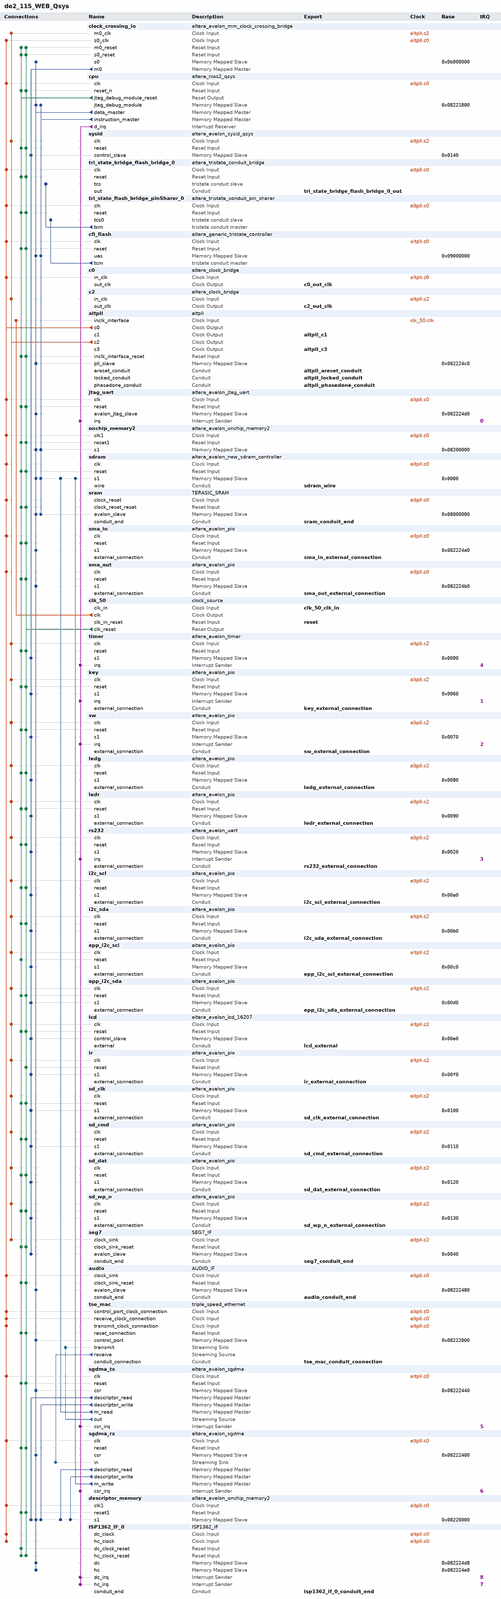
[diagram p0: system contents, whole]
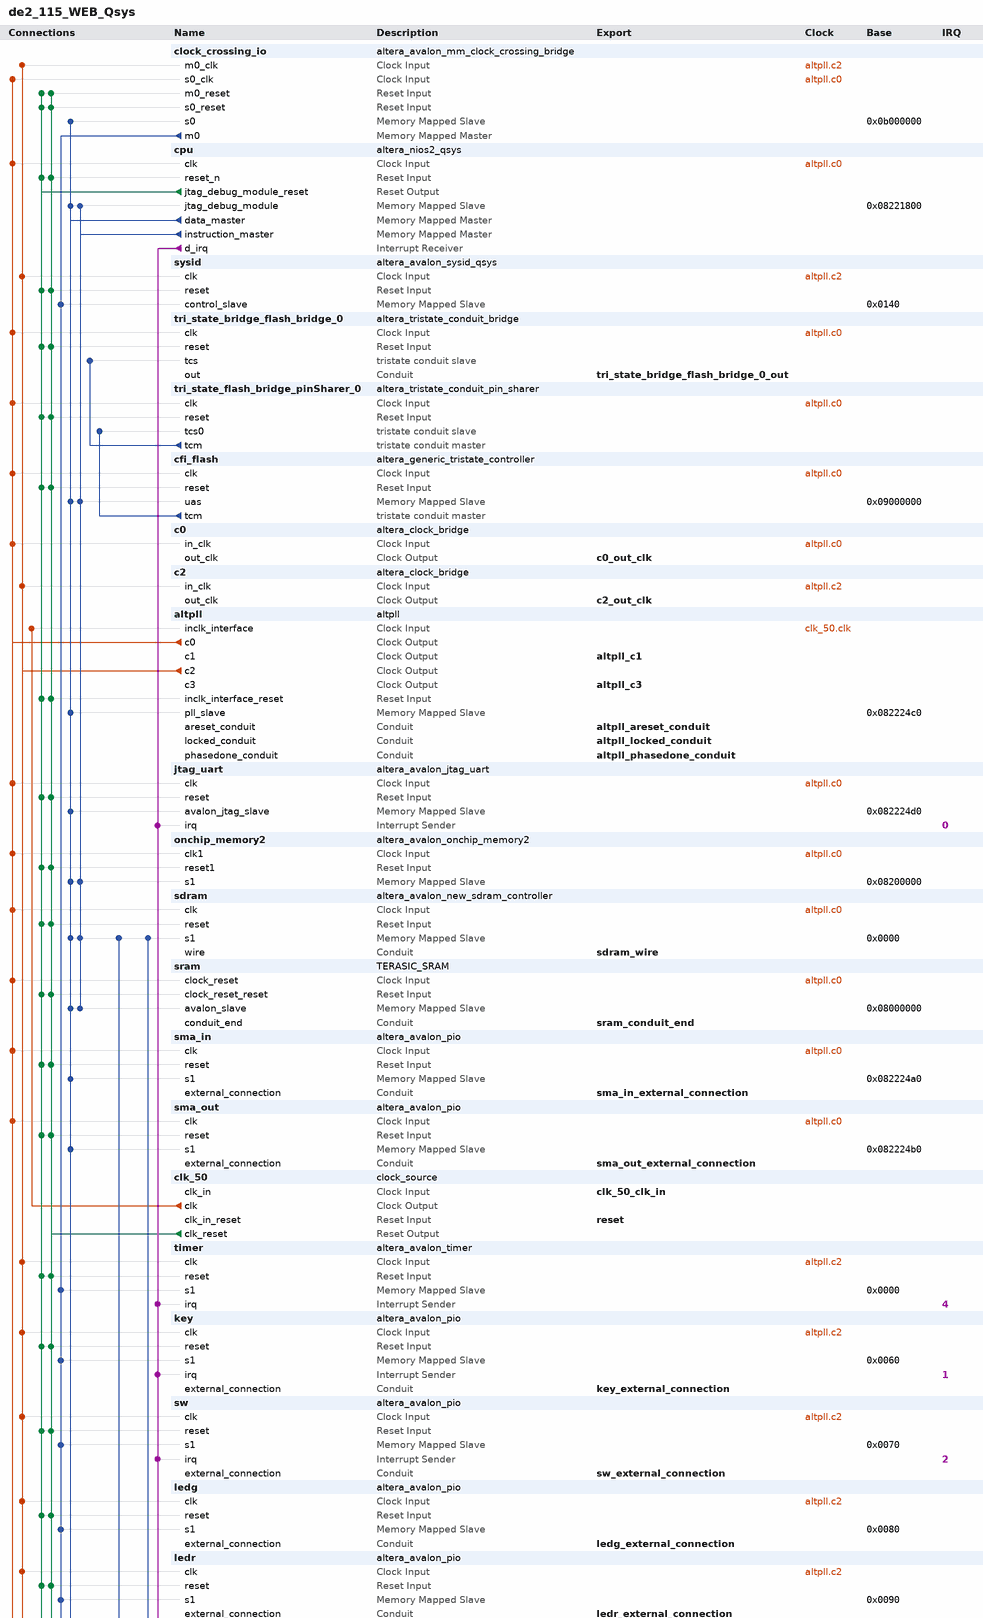
[diagram p1: system contents, upper part]
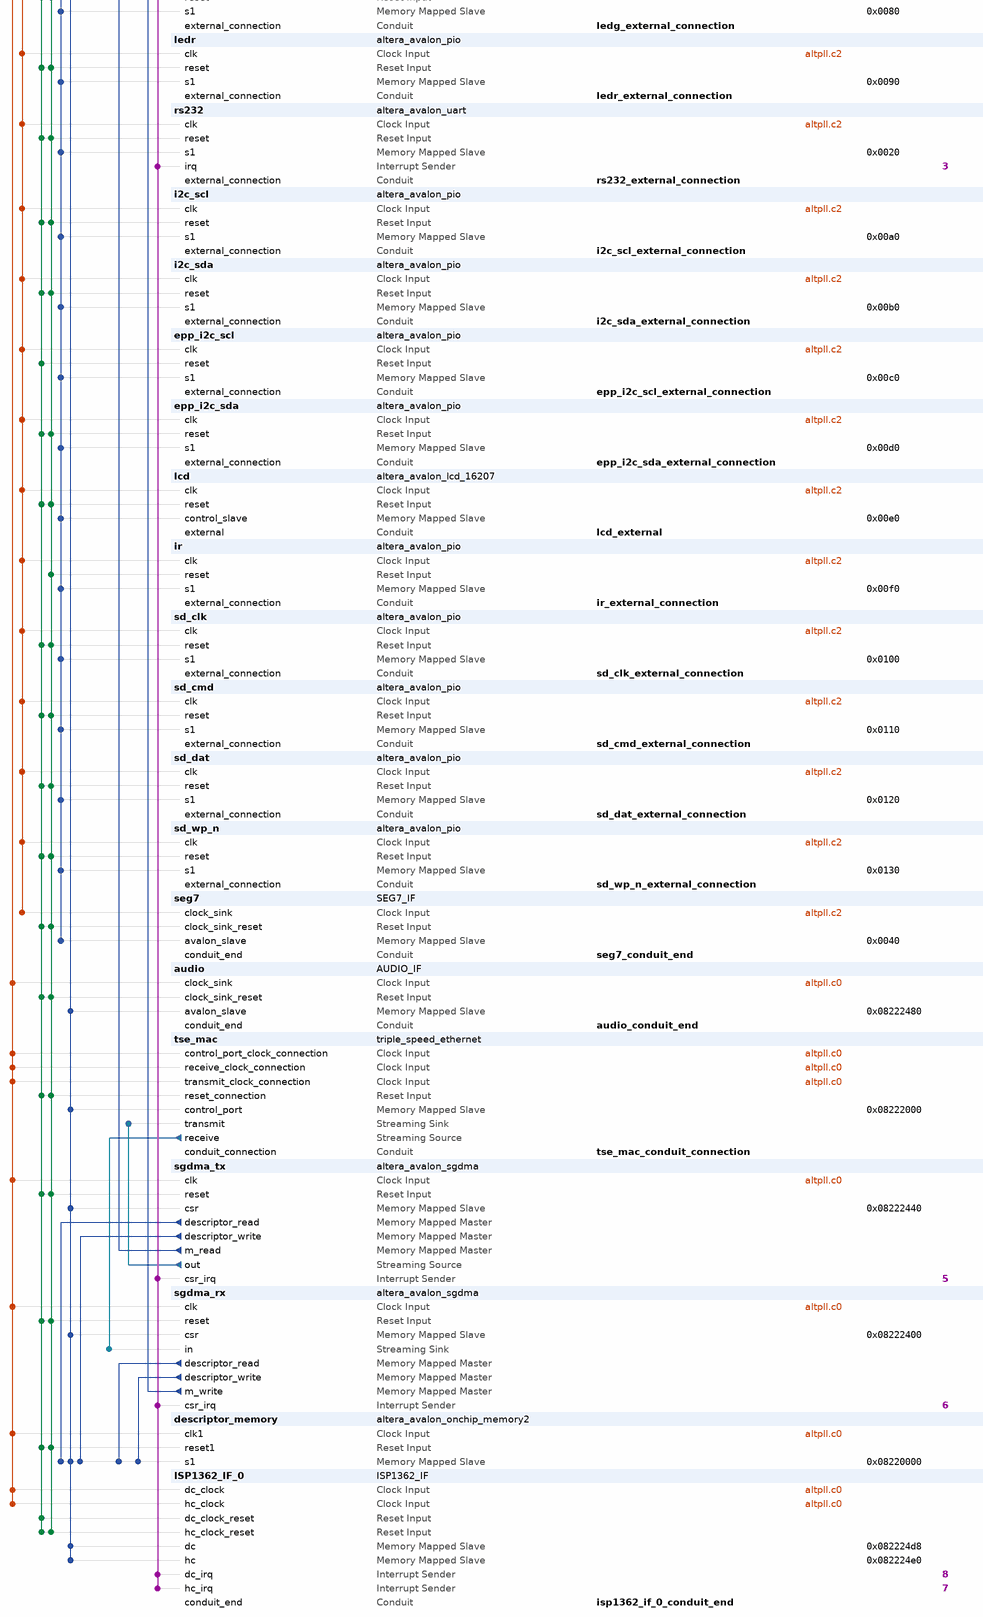
[diagram p2: system contents, lower part]
# Platform Designer (Qsys) system de2_115_WEB_Qsys, Cyclone IV E EP4CE115F29C7
# Parameters at their usual value, and those the tool derives, are not listed.
package require -exact qsys 12.0
create_system de2_115_WEB_Qsys
set_project_property DEVICE_FAMILY {Cyclone IV E}
set_project_property DEVICE EP4CE115F29C7

add_instance clock_crossing_io altera_avalon_mm_clock_crossing_bridge 12.0
set_instance_parameter_value clock_crossing_io DATA_WIDTH 32
set_instance_parameter_value clock_crossing_io ADDRESS_WIDTH 9
set_instance_parameter_value clock_crossing_io MAX_BURST_SIZE 1
set_instance_parameter_value clock_crossing_io COMMAND_FIFO_DEPTH 32
set_instance_parameter_value clock_crossing_io RESPONSE_FIFO_DEPTH 256
set_instance_parameter_value clock_crossing_io MASTER_SYNC_DEPTH 3
set_instance_parameter_value clock_crossing_io SLAVE_SYNC_DEPTH 3

add_instance cpu altera_nios2_qsys 12.0
set_instance_parameter_value cpu resetSlave sdram.s1
set_instance_parameter_value cpu exceptionSlave sdram.s1
set_instance_parameter_value cpu breakSlave cpu.jtag_debug_module
set_instance_parameter_value cpu impl Fast
set_instance_parameter_value cpu icache_size 4096

add_instance sysid altera_avalon_sysid_qsys 12.0
set_instance_parameter_value sysid id 0

add_instance tri_state_bridge_flash_bridge_0 altera_tristate_conduit_bridge 12.0

add_instance tri_state_flash_bridge_pinSharer_0 altera_tristate_conduit_pin_sharer 12.0
set_instance_parameter_value tri_state_flash_bridge_pinSharer_0 NUM_INTERFACES 1
set_instance_parameter_value tri_state_flash_bridge_pinSharer_0 MODULE_ORIGIN_LIST cfi_flash.tcm,cfi_flash.tcm,cfi_flash.tcm,cfi_flash.tcm,cfi_flash.tcm
set_instance_parameter_value tri_state_flash_bridge_pinSharer_0 SHARED_SIGNAL_LIST address_to_the_cfi_flash,read_n_to_the_cfi_flash,write_n_to_the_cfi_flash,tri_state_bridge_flash_data,select_n_to_the_cfi_flash

add_instance cfi_flash altera_generic_tristate_controller 12.0
set_instance_parameter_value cfi_flash TCM_ADDRESS_W 23
set_instance_parameter_value cfi_flash TCM_DATA_W 8
set_instance_parameter_value cfi_flash TCM_BYTEENABLE_W 1
set_instance_parameter_value cfi_flash TCM_READ_WAIT 160
set_instance_parameter_value cfi_flash TCM_WRITE_WAIT 160
set_instance_parameter_value cfi_flash TCM_SETUP_WAIT 60
set_instance_parameter_value cfi_flash TCM_DATA_HOLD 60
set_instance_parameter_value cfi_flash TCM_MAX_PENDING_READ_TRANSACTIONS 3
set_instance_parameter_value cfi_flash TCM_TURNAROUND_TIME 2
set_instance_parameter_value cfi_flash TCM_TIMING_UNITS 0
set_instance_parameter_value cfi_flash TCM_READLATENCY 2
set_instance_parameter_value cfi_flash TCM_SYMBOLS_PER_WORD 1
set_instance_parameter_value cfi_flash USE_READ 1
set_instance_parameter_value cfi_flash USE_BEGINTRANSFER 0
set_instance_parameter_value cfi_flash USE_BYTEENABLE 0
set_instance_parameter_value cfi_flash USE_OUTPUTENABLE 0
set_instance_parameter_value cfi_flash ACTIVE_LOW_READ 1
set_instance_parameter_value cfi_flash ACTIVE_LOW_BYTEENABLE 0
set_instance_parameter_value cfi_flash ACTIVE_LOW_OUTPUTENABLE 0
set_instance_parameter_value cfi_flash ACTIVE_LOW_BEGINTRANSFER 0
set_instance_parameter_value cfi_flash CHIPSELECT_THROUGH_READLATENCY 0
set_instance_parameter_value cfi_flash MODULE_ASSIGNMENT_KEYS embeddedsw.configuration.hwClassnameDriverSupportList,embeddedsw.configuration.hwClassnameDriverSupportDefault,embeddedsw.CMacro.SETUP_VALUE,embeddedsw.CMacro.WAIT_VALUE,embeddedsw.CMacro.HOLD_VALUE,embeddedsw.CMacro.TIMING_UNITS,embeddedsw.CMacro.SIZE,embeddedsw.memoryInfo.MEM_INIT_DATA_WIDTH,embeddedsw.memoryInfo.HAS_BYTE_LANE,embeddedsw.memoryInfo.IS_FLASH,embeddedsw.memoryInfo.GENERATE_DAT_SYM,embeddedsw.memoryInfo.GENERATE_FLASH,embeddedsw.memoryInfo.DAT_SYM_INSTALL_DIR,embeddedsw.memoryInfo.FLASH_INSTALL_DIR
set_instance_parameter_value cfi_flash MODULE_ASSIGNMENT_VALUES altera_avalon_lan91c111:altera_avalon_cfi_flash,altera_avalon_cfi_flash,60,160,60,ns,8388608u,8,0,1,1,1,SIM_DIR,APP_DIR
set_instance_parameter_value cfi_flash INTERFACE_ASSIGNMENT_KEYS embeddedsw.configuration.isFlash,embeddedsw.configuration.isMemoryDevice,embeddedsw.configuration.isNonVolatileStorage
set_instance_parameter_value cfi_flash INTERFACE_ASSIGNMENT_VALUES 1,1,1

add_instance c0 altera_clock_bridge 12.0
set_instance_parameter_value c0 DERIVED_CLOCK_RATE 100000000
set_instance_parameter_value c0 EXPLICIT_CLOCK_RATE 0

add_instance c2 altera_clock_bridge 12.0
set_instance_parameter_value c2 DERIVED_CLOCK_RATE 10000000
set_instance_parameter_value c2 EXPLICIT_CLOCK_RATE 0

add_instance altpll altpll 12.0
set_instance_parameter_value altpll INCLK0_INPUT_FREQUENCY 20000
set_instance_parameter_value altpll CLK0_MULTIPLY_BY 2
set_instance_parameter_value altpll CLK1_MULTIPLY_BY 2
set_instance_parameter_value altpll CLK2_MULTIPLY_BY 1
set_instance_parameter_value altpll CLK3_MULTIPLY_BY 1
set_instance_parameter_value altpll CLK0_DIVIDE_BY 1
set_instance_parameter_value altpll CLK1_DIVIDE_BY 1
set_instance_parameter_value altpll CLK2_DIVIDE_BY 5
set_instance_parameter_value altpll CLK3_DIVIDE_BY 2
set_instance_parameter_value altpll CLK1_PHASE_SHIFT -1806
set_instance_parameter_value altpll CLK2_PHASE_SHIFT 0
set_instance_parameter_value altpll CLK3_PHASE_SHIFT 0
set_instance_parameter_value altpll CLK1_DUTY_CYCLE 50
set_instance_parameter_value altpll CLK2_DUTY_CYCLE 50
set_instance_parameter_value altpll CLK3_DUTY_CYCLE 50
set_instance_parameter_value altpll PORT_clk1 PORT_USED
set_instance_parameter_value altpll PORT_clk2 PORT_USED
set_instance_parameter_value altpll PORT_clk3 PORT_USED
set_instance_parameter_value altpll PORT_ARESET PORT_USED
set_instance_parameter_value altpll PORT_LOCKED PORT_USED

add_instance jtag_uart altera_avalon_jtag_uart 12.0
set_instance_parameter_value jtag_uart simInteractiveOptions INTERACTIVE_ASCII_OUTPUT

add_instance onchip_memory2 altera_avalon_onchip_memory2 12.0
set_instance_parameter_value onchip_memory2 dataWidth 32
set_instance_parameter_value onchip_memory2 dualPort false
set_instance_parameter_value onchip_memory2 initMemContent true
set_instance_parameter_value onchip_memory2 initializationFileName onchip_memory2
set_instance_parameter_value onchip_memory2 memorySize 131072

add_instance sdram altera_avalon_new_sdram_controller 12.0
set_instance_parameter_value sdram TAC 5.5
set_instance_parameter_value sdram TRCD 20.0
set_instance_parameter_value sdram TRP 20.0
set_instance_parameter_value sdram casLatency 3
set_instance_parameter_value sdram columnWidth 10
set_instance_parameter_value sdram dataWidth 32
set_instance_parameter_value sdram generateSimulationModel true
set_instance_parameter_value sdram model custom
set_instance_parameter_value sdram numberOfBanks 4
set_instance_parameter_value sdram numberOfChipSelects 1
set_instance_parameter_value sdram powerUpDelay 100.0
set_instance_parameter_value sdram refreshPeriod 15.625
set_instance_parameter_value sdram rowWidth 13

add_instance sram TERASIC_SRAM 1.0
set_instance_parameter_value sram DATA_BITS 16
set_instance_parameter_value sram ADDR_BITS 20

add_instance sma_in altera_avalon_pio 12.0
set_instance_parameter_value sma_in direction Input
set_instance_parameter_value sma_in width 1

add_instance sma_out altera_avalon_pio 12.0
set_instance_parameter_value sma_out direction Output
set_instance_parameter_value sma_out width 1

add_instance clk_50 clock_source 12.0
set_instance_parameter_value clk_50 clockFrequency 50000000

add_instance timer altera_avalon_timer 12.0
set_instance_parameter_value timer period 1
set_instance_parameter_value timer periodUnits MSEC
set_instance_parameter_value timer timerPreset CUSTOM

add_instance key altera_avalon_pio 12.0
set_instance_parameter_value key captureEdge true
set_instance_parameter_value key direction Input
set_instance_parameter_value key edgeType FALLING
set_instance_parameter_value key generateIRQ true
set_instance_parameter_value key irqType EDGE
set_instance_parameter_value key width 4

add_instance sw altera_avalon_pio 12.0
set_instance_parameter_value sw captureEdge true
set_instance_parameter_value sw direction Input
set_instance_parameter_value sw edgeType FALLING
set_instance_parameter_value sw generateIRQ true
set_instance_parameter_value sw irqType EDGE
set_instance_parameter_value sw width 18

add_instance ledg altera_avalon_pio 12.0
set_instance_parameter_value ledg direction Output
set_instance_parameter_value ledg width 9

add_instance ledr altera_avalon_pio 12.0
set_instance_parameter_value ledr direction Output
set_instance_parameter_value ledr width 18

add_instance rs232 altera_avalon_uart 12.0
set_instance_parameter_value rs232 baud 115200
set_instance_parameter_value rs232 dataBits 8
set_instance_parameter_value rs232 fixedBaud true
set_instance_parameter_value rs232 parity NONE
set_instance_parameter_value rs232 stopBits 1
set_instance_parameter_value rs232 useCtsRts true

add_instance i2c_scl altera_avalon_pio 12.0
set_instance_parameter_value i2c_scl direction Output
set_instance_parameter_value i2c_scl width 1

add_instance i2c_sda altera_avalon_pio 12.0
set_instance_parameter_value i2c_sda direction Bidir
set_instance_parameter_value i2c_sda width 1

add_instance epp_i2c_scl altera_avalon_pio 12.0
set_instance_parameter_value epp_i2c_scl direction Output
set_instance_parameter_value epp_i2c_scl width 1

add_instance epp_i2c_sda altera_avalon_pio 12.0
set_instance_parameter_value epp_i2c_sda direction Bidir
set_instance_parameter_value epp_i2c_sda width 1

add_instance lcd altera_avalon_lcd_16207 12.0

add_instance ir altera_avalon_pio 12.0
set_instance_parameter_value ir direction Input
set_instance_parameter_value ir width 1

add_instance sd_clk altera_avalon_pio 12.0
set_instance_parameter_value sd_clk direction Output
set_instance_parameter_value sd_clk width 1

add_instance sd_cmd altera_avalon_pio 12.0
set_instance_parameter_value sd_cmd direction Bidir
set_instance_parameter_value sd_cmd width 1

add_instance sd_dat altera_avalon_pio 12.0
set_instance_parameter_value sd_dat direction Bidir
set_instance_parameter_value sd_dat width 4

add_instance sd_wp_n altera_avalon_pio 12.0
set_instance_parameter_value sd_wp_n direction Input
set_instance_parameter_value sd_wp_n width 1

add_instance seg7 SEG7_IF 1.0
set_instance_parameter_value seg7 SEG7_NUM 8

add_instance audio AUDIO_IF 1.0

add_instance tse_mac triple_speed_ethernet 12.0
set_instance_parameter_value tse_mac atlanticSinkClockRate 0
set_instance_parameter_value tse_mac atlanticSinkClockSource unassigned
set_instance_parameter_value tse_mac atlanticSourceClockRate 0
set_instance_parameter_value tse_mac atlanticSourceClockSource unassigned
set_instance_parameter_value tse_mac avalonSlaveClockRate 0
set_instance_parameter_value tse_mac avalonSlaveClockSource unassigned
set_instance_parameter_value tse_mac avalonStNeighbours {unassigned=unassigned}
set_instance_parameter_value tse_mac channel_count 1
set_instance_parameter_value tse_mac core_variation SMALL_MAC_10_100
set_instance_parameter_value tse_mac core_version 3072
set_instance_parameter_value tse_mac crc32check16bit 0
set_instance_parameter_value tse_mac crc32dwidth 8
set_instance_parameter_value tse_mac crc32gendelay 6
set_instance_parameter_value tse_mac crc32s1l2_extern false
set_instance_parameter_value tse_mac cust_version 0
set_instance_parameter_value tse_mac dataBitsPerSymbol 8
set_instance_parameter_value tse_mac dev_version 3072
set_instance_parameter_value tse_mac eg_addr 11
set_instance_parameter_value tse_mac ena_hash false
set_instance_parameter_value tse_mac enable_alt_reconfig false
set_instance_parameter_value tse_mac enable_clk_sharing false
set_instance_parameter_value tse_mac enable_ena 32
set_instance_parameter_value tse_mac enable_fifoless false
set_instance_parameter_value tse_mac enable_gmii_loopback false
set_instance_parameter_value tse_mac enable_hd_logic true
set_instance_parameter_value tse_mac enable_mac_flow_ctrl false
set_instance_parameter_value tse_mac enable_mac_txaddr_set true
set_instance_parameter_value tse_mac enable_mac_vlan false
set_instance_parameter_value tse_mac enable_maclite true
set_instance_parameter_value tse_mac enable_magic_detect false
set_instance_parameter_value tse_mac enable_multi_channel false
set_instance_parameter_value tse_mac enable_pkt_class true
set_instance_parameter_value tse_mac enable_pma false
set_instance_parameter_value tse_mac enable_ptp_1step false
set_instance_parameter_value tse_mac enable_reg_sharing false
set_instance_parameter_value tse_mac enable_sgmii false
set_instance_parameter_value tse_mac enable_shift16 true
set_instance_parameter_value tse_mac enable_sup_addr false
set_instance_parameter_value tse_mac enable_timestamping false
set_instance_parameter_value tse_mac enable_use_internal_fifo true
set_instance_parameter_value tse_mac export_calblkclk false
set_instance_parameter_value tse_mac export_pwrdn false
set_instance_parameter_value tse_mac ext_stat_cnt_ena false
set_instance_parameter_value tse_mac gigeAdvanceMode true
set_instance_parameter_value tse_mac ifGMII MII
set_instance_parameter_value tse_mac ifPCSuseEmbeddedSerdes false
set_instance_parameter_value tse_mac ing_addr 11
set_instance_parameter_value tse_mac insert_ta true
set_instance_parameter_value tse_mac maclite_gige false
set_instance_parameter_value tse_mac max_channels 1
set_instance_parameter_value tse_mac mdio_clk_div 40
set_instance_parameter_value tse_mac phy_identifier 0
set_instance_parameter_value tse_mac ramType AUTO
set_instance_parameter_value tse_mac reset_level 1
set_instance_parameter_value tse_mac starting_channel_number 0
set_instance_parameter_value tse_mac stat_cnt_ena false
set_instance_parameter_value tse_mac timingAdapterName timingAdapter
set_instance_parameter_value tse_mac toolContext SOPC_BUILDER
set_instance_parameter_value tse_mac transceiver_type GXB
set_instance_parameter_value tse_mac tstamp_fp_width 4
set_instance_parameter_value tse_mac uiHostClockFrequency 0
set_instance_parameter_value tse_mac uiMDIOFreq {0.0 MHz}
set_instance_parameter_value tse_mac useLvds false
set_instance_parameter_value tse_mac useMAC true
set_instance_parameter_value tse_mac useMDIO true
set_instance_parameter_value tse_mac usePCS false
set_instance_parameter_value tse_mac use_sync_reset true

add_instance sgdma_tx altera_avalon_sgdma 12.0
set_instance_parameter_value sgdma_tx enableBurstTransfers false
set_instance_parameter_value sgdma_tx enableUnalignedTransfers false
set_instance_parameter_value sgdma_tx readBlockDataWidth 32
set_instance_parameter_value sgdma_tx sinkErrorWidth 0
set_instance_parameter_value sgdma_tx sourceErrorWidth 1
set_instance_parameter_value sgdma_tx transferMode MEMORY_TO_STREAM
set_instance_parameter_value sgdma_tx writeBurstcountWidth 4

add_instance sgdma_rx altera_avalon_sgdma 12.0
set_instance_parameter_value sgdma_rx enableBurstTransfers false
set_instance_parameter_value sgdma_rx enableUnalignedTransfers false
set_instance_parameter_value sgdma_rx readBlockDataWidth 32
set_instance_parameter_value sgdma_rx sinkErrorWidth 6
set_instance_parameter_value sgdma_rx sourceErrorWidth 0
set_instance_parameter_value sgdma_rx transferMode STREAM_TO_MEMORY
set_instance_parameter_value sgdma_rx writeBurstcountWidth 4

add_instance descriptor_memory altera_avalon_onchip_memory2 12.0
set_instance_parameter_value descriptor_memory dataWidth 32
set_instance_parameter_value descriptor_memory dualPort false
set_instance_parameter_value descriptor_memory initMemContent true
set_instance_parameter_value descriptor_memory initializationFileName descriptor_memory
set_instance_parameter_value descriptor_memory memorySize 4096

add_instance ISP1362_IF_0 ISP1362_IF 1.0

# connections
add_connection altpll.c0 audio.clock_sink clock
add_connection altpll.c0 c0.in_clk clock
add_connection altpll.c0 cfi_flash.clk clock
add_connection altpll.c0 clock_crossing_io.s0_clk clock
add_connection altpll.c0 cpu.clk clock
add_connection altpll.c0 descriptor_memory.clk1 clock
add_connection altpll.c0 ISP1362_IF_0.dc_clock clock
add_connection altpll.c0 ISP1362_IF_0.hc_clock clock
add_connection altpll.c0 jtag_uart.clk clock
add_connection altpll.c0 onchip_memory2.clk1 clock
add_connection altpll.c0 sdram.clk clock
add_connection altpll.c0 sgdma_rx.clk clock
add_connection altpll.c0 sgdma_tx.clk clock
add_connection altpll.c0 sma_in.clk clock
add_connection altpll.c0 sma_out.clk clock
add_connection altpll.c0 sram.clock_reset clock
add_connection altpll.c0 tri_state_bridge_flash_bridge_0.clk clock
add_connection altpll.c0 tri_state_flash_bridge_pinSharer_0.clk clock
add_connection altpll.c0 tse_mac.control_port_clock_connection clock
add_connection altpll.c0 tse_mac.receive_clock_connection clock
add_connection altpll.c0 tse_mac.transmit_clock_connection clock
add_connection altpll.c2 c2.in_clk clock
add_connection altpll.c2 clock_crossing_io.m0_clk clock
add_connection altpll.c2 epp_i2c_scl.clk clock
add_connection altpll.c2 epp_i2c_sda.clk clock
add_connection altpll.c2 i2c_scl.clk clock
add_connection altpll.c2 i2c_sda.clk clock
add_connection altpll.c2 ir.clk clock
add_connection altpll.c2 key.clk clock
add_connection altpll.c2 lcd.clk clock
add_connection altpll.c2 ledg.clk clock
add_connection altpll.c2 ledr.clk clock
add_connection altpll.c2 rs232.clk clock
add_connection altpll.c2 sd_clk.clk clock
add_connection altpll.c2 sd_cmd.clk clock
add_connection altpll.c2 sd_dat.clk clock
add_connection altpll.c2 sd_wp_n.clk clock
add_connection altpll.c2 seg7.clock_sink clock
add_connection altpll.c2 sw.clk clock
add_connection altpll.c2 sysid.clk clock
add_connection altpll.c2 timer.clk clock
add_connection clk_50.clk altpll.inclk_interface clock
add_connection clk_50.clk_reset altpll.inclk_interface_reset reset
add_connection clk_50.clk_reset audio.clock_sink_reset reset
add_connection clk_50.clk_reset cfi_flash.reset reset
add_connection clk_50.clk_reset clock_crossing_io.m0_reset reset
add_connection clk_50.clk_reset clock_crossing_io.s0_reset reset
add_connection clk_50.clk_reset cpu.reset_n reset
add_connection clk_50.clk_reset descriptor_memory.reset1 reset
add_connection clk_50.clk_reset epp_i2c_sda.reset reset
add_connection clk_50.clk_reset i2c_scl.reset reset
add_connection clk_50.clk_reset i2c_sda.reset reset
add_connection clk_50.clk_reset ir.reset reset
add_connection clk_50.clk_reset ISP1362_IF_0.hc_clock_reset reset
add_connection clk_50.clk_reset jtag_uart.reset reset
add_connection clk_50.clk_reset key.reset reset
add_connection clk_50.clk_reset lcd.reset reset
add_connection clk_50.clk_reset ledg.reset reset
add_connection clk_50.clk_reset ledr.reset reset
add_connection clk_50.clk_reset onchip_memory2.reset1 reset
add_connection clk_50.clk_reset rs232.reset reset
add_connection clk_50.clk_reset sd_clk.reset reset
add_connection clk_50.clk_reset sd_cmd.reset reset
add_connection clk_50.clk_reset sd_dat.reset reset
add_connection clk_50.clk_reset sd_wp_n.reset reset
add_connection clk_50.clk_reset sdram.reset reset
add_connection clk_50.clk_reset seg7.clock_sink_reset reset
add_connection clk_50.clk_reset sgdma_rx.reset reset
add_connection clk_50.clk_reset sgdma_tx.reset reset
add_connection clk_50.clk_reset sma_in.reset reset
add_connection clk_50.clk_reset sma_out.reset reset
add_connection clk_50.clk_reset sram.clock_reset_reset reset
add_connection clk_50.clk_reset sw.reset reset
add_connection clk_50.clk_reset sysid.reset reset
add_connection clk_50.clk_reset timer.reset reset
add_connection clk_50.clk_reset tri_state_bridge_flash_bridge_0.reset reset
add_connection clk_50.clk_reset tri_state_flash_bridge_pinSharer_0.reset reset
add_connection clk_50.clk_reset tse_mac.reset_connection reset
add_connection cpu.jtag_debug_module_reset altpll.inclk_interface_reset reset
add_connection cpu.jtag_debug_module_reset audio.clock_sink_reset reset
add_connection cpu.jtag_debug_module_reset cfi_flash.reset reset
add_connection cpu.jtag_debug_module_reset clock_crossing_io.m0_reset reset
add_connection cpu.jtag_debug_module_reset clock_crossing_io.s0_reset reset
add_connection cpu.jtag_debug_module_reset cpu.reset_n reset
add_connection cpu.jtag_debug_module_reset descriptor_memory.reset1 reset
add_connection cpu.jtag_debug_module_reset epp_i2c_scl.reset reset
add_connection cpu.jtag_debug_module_reset epp_i2c_sda.reset reset
add_connection cpu.jtag_debug_module_reset i2c_scl.reset reset
add_connection cpu.jtag_debug_module_reset i2c_sda.reset reset
add_connection cpu.jtag_debug_module_reset ISP1362_IF_0.dc_clock_reset reset
add_connection cpu.jtag_debug_module_reset ISP1362_IF_0.hc_clock_reset reset
add_connection cpu.jtag_debug_module_reset jtag_uart.reset reset
add_connection cpu.jtag_debug_module_reset key.reset reset
add_connection cpu.jtag_debug_module_reset lcd.reset reset
add_connection cpu.jtag_debug_module_reset ledg.reset reset
add_connection cpu.jtag_debug_module_reset ledr.reset reset
add_connection cpu.jtag_debug_module_reset onchip_memory2.reset1 reset
add_connection cpu.jtag_debug_module_reset rs232.reset reset
add_connection cpu.jtag_debug_module_reset sd_clk.reset reset
add_connection cpu.jtag_debug_module_reset sd_cmd.reset reset
add_connection cpu.jtag_debug_module_reset sd_dat.reset reset
add_connection cpu.jtag_debug_module_reset sd_wp_n.reset reset
add_connection cpu.jtag_debug_module_reset sdram.reset reset
add_connection cpu.jtag_debug_module_reset seg7.clock_sink_reset reset
add_connection cpu.jtag_debug_module_reset sgdma_rx.reset reset
add_connection cpu.jtag_debug_module_reset sgdma_tx.reset reset
add_connection cpu.jtag_debug_module_reset sma_in.reset reset
add_connection cpu.jtag_debug_module_reset sma_out.reset reset
add_connection cpu.jtag_debug_module_reset sram.clock_reset_reset reset
add_connection cpu.jtag_debug_module_reset sw.reset reset
add_connection cpu.jtag_debug_module_reset sysid.reset reset
add_connection cpu.jtag_debug_module_reset timer.reset reset
add_connection cpu.jtag_debug_module_reset tri_state_bridge_flash_bridge_0.reset reset
add_connection cpu.jtag_debug_module_reset tri_state_flash_bridge_pinSharer_0.reset reset
add_connection cpu.jtag_debug_module_reset tse_mac.reset_connection reset
add_connection clock_crossing_io.m0 epp_i2c_scl.s1 avalon
set_connection_parameter_value clock_crossing_io.m0/epp_i2c_scl.s1 baseAddress 0x00c0
add_connection clock_crossing_io.m0 epp_i2c_sda.s1 avalon
set_connection_parameter_value clock_crossing_io.m0/epp_i2c_sda.s1 baseAddress 0x00d0
add_connection clock_crossing_io.m0 i2c_scl.s1 avalon
set_connection_parameter_value clock_crossing_io.m0/i2c_scl.s1 baseAddress 0x00a0
add_connection clock_crossing_io.m0 i2c_sda.s1 avalon
set_connection_parameter_value clock_crossing_io.m0/i2c_sda.s1 baseAddress 0x00b0
add_connection clock_crossing_io.m0 ir.s1 avalon
set_connection_parameter_value clock_crossing_io.m0/ir.s1 baseAddress 0x00f0
add_connection clock_crossing_io.m0 key.s1 avalon
set_connection_parameter_value clock_crossing_io.m0/key.s1 baseAddress 0x0060
add_connection clock_crossing_io.m0 lcd.control_slave avalon
set_connection_parameter_value clock_crossing_io.m0/lcd.control_slave baseAddress 0x00e0
add_connection clock_crossing_io.m0 ledg.s1 avalon
set_connection_parameter_value clock_crossing_io.m0/ledg.s1 baseAddress 0x0080
add_connection clock_crossing_io.m0 ledr.s1 avalon
set_connection_parameter_value clock_crossing_io.m0/ledr.s1 baseAddress 0x0090
add_connection clock_crossing_io.m0 rs232.s1 avalon
set_connection_parameter_value clock_crossing_io.m0/rs232.s1 baseAddress 0x0020
add_connection clock_crossing_io.m0 sd_clk.s1 avalon
set_connection_parameter_value clock_crossing_io.m0/sd_clk.s1 baseAddress 0x0100
add_connection clock_crossing_io.m0 sd_cmd.s1 avalon
set_connection_parameter_value clock_crossing_io.m0/sd_cmd.s1 baseAddress 0x0110
add_connection clock_crossing_io.m0 sd_dat.s1 avalon
set_connection_parameter_value clock_crossing_io.m0/sd_dat.s1 baseAddress 0x0120
add_connection clock_crossing_io.m0 sd_wp_n.s1 avalon
set_connection_parameter_value clock_crossing_io.m0/sd_wp_n.s1 baseAddress 0x0130
add_connection clock_crossing_io.m0 seg7.avalon_slave avalon
set_connection_parameter_value clock_crossing_io.m0/seg7.avalon_slave baseAddress 0x0040
add_connection clock_crossing_io.m0 sw.s1 avalon
set_connection_parameter_value clock_crossing_io.m0/sw.s1 baseAddress 0x0070
add_connection clock_crossing_io.m0 sysid.control_slave avalon
set_connection_parameter_value clock_crossing_io.m0/sysid.control_slave baseAddress 0x0140
add_connection clock_crossing_io.m0 timer.s1 avalon
set_connection_parameter_value clock_crossing_io.m0/timer.s1 baseAddress 0x0000
add_connection cpu.data_master altpll.pll_slave avalon
set_connection_parameter_value cpu.data_master/altpll.pll_slave baseAddress 0x082224c0
add_connection cpu.data_master audio.avalon_slave avalon
set_connection_parameter_value cpu.data_master/audio.avalon_slave baseAddress 0x08222480
add_connection cpu.data_master cfi_flash.uas avalon
set_connection_parameter_value cpu.data_master/cfi_flash.uas baseAddress 0x09000000
add_connection cpu.data_master clock_crossing_io.s0 avalon
set_connection_parameter_value cpu.data_master/clock_crossing_io.s0 baseAddress 0x0b000000
add_connection cpu.data_master cpu.jtag_debug_module avalon
set_connection_parameter_value cpu.data_master/cpu.jtag_debug_module baseAddress 0x08221800
add_connection cpu.data_master descriptor_memory.s1 avalon
set_connection_parameter_value cpu.data_master/descriptor_memory.s1 baseAddress 0x08220000
add_connection cpu.data_master ISP1362_IF_0.dc avalon
set_connection_parameter_value cpu.data_master/ISP1362_IF_0.dc baseAddress 0x082224d8
add_connection cpu.data_master ISP1362_IF_0.hc avalon
set_connection_parameter_value cpu.data_master/ISP1362_IF_0.hc baseAddress 0x082224e0
add_connection cpu.data_master jtag_uart.avalon_jtag_slave avalon
set_connection_parameter_value cpu.data_master/jtag_uart.avalon_jtag_slave baseAddress 0x082224d0
add_connection cpu.data_master onchip_memory2.s1 avalon
set_connection_parameter_value cpu.data_master/onchip_memory2.s1 baseAddress 0x08200000
add_connection cpu.data_master sdram.s1 avalon
set_connection_parameter_value cpu.data_master/sdram.s1 baseAddress 0x0000
add_connection cpu.data_master sgdma_rx.csr avalon
set_connection_parameter_value cpu.data_master/sgdma_rx.csr baseAddress 0x08222400
add_connection cpu.data_master sgdma_tx.csr avalon
set_connection_parameter_value cpu.data_master/sgdma_tx.csr baseAddress 0x08222440
add_connection cpu.data_master sma_in.s1 avalon
set_connection_parameter_value cpu.data_master/sma_in.s1 baseAddress 0x082224a0
add_connection cpu.data_master sma_out.s1 avalon
set_connection_parameter_value cpu.data_master/sma_out.s1 baseAddress 0x082224b0
add_connection cpu.data_master sram.avalon_slave avalon
set_connection_parameter_value cpu.data_master/sram.avalon_slave baseAddress 0x08000000
add_connection cpu.data_master tse_mac.control_port avalon
set_connection_parameter_value cpu.data_master/tse_mac.control_port baseAddress 0x08222000
add_connection cpu.instruction_master cfi_flash.uas avalon
set_connection_parameter_value cpu.instruction_master/cfi_flash.uas baseAddress 0x09000000
add_connection cpu.instruction_master cpu.jtag_debug_module avalon
set_connection_parameter_value cpu.instruction_master/cpu.jtag_debug_module baseAddress 0x08221800
add_connection cpu.instruction_master onchip_memory2.s1 avalon
set_connection_parameter_value cpu.instruction_master/onchip_memory2.s1 baseAddress 0x08200000
add_connection cpu.instruction_master sdram.s1 avalon
set_connection_parameter_value cpu.instruction_master/sdram.s1 baseAddress 0x0000
add_connection cpu.instruction_master sram.avalon_slave avalon
set_connection_parameter_value cpu.instruction_master/sram.avalon_slave baseAddress 0x08000000
add_connection sgdma_rx.descriptor_read descriptor_memory.s1 avalon
set_connection_parameter_value sgdma_rx.descriptor_read/descriptor_memory.s1 baseAddress 0x08220000
add_connection sgdma_rx.descriptor_write descriptor_memory.s1 avalon
set_connection_parameter_value sgdma_rx.descriptor_write/descriptor_memory.s1 baseAddress 0x08220000
add_connection sgdma_rx.m_write sdram.s1 avalon
set_connection_parameter_value sgdma_rx.m_write/sdram.s1 baseAddress 0x0000
add_connection sgdma_tx.descriptor_read descriptor_memory.s1 avalon
set_connection_parameter_value sgdma_tx.descriptor_read/descriptor_memory.s1 baseAddress 0x08220000
add_connection sgdma_tx.descriptor_write descriptor_memory.s1 avalon
set_connection_parameter_value sgdma_tx.descriptor_write/descriptor_memory.s1 baseAddress 0x08220000
add_connection sgdma_tx.m_read sdram.s1 avalon
set_connection_parameter_value sgdma_tx.m_read/sdram.s1 baseAddress 0x0000
add_connection sgdma_tx.out tse_mac.transmit avalon_streaming
add_connection tse_mac.receive sgdma_rx.in avalon_streaming
add_connection cpu.d_irq ISP1362_IF_0.dc_irq interrupt
set_connection_parameter_value cpu.d_irq/ISP1362_IF_0.dc_irq irqNumber 8
add_connection cpu.d_irq ISP1362_IF_0.hc_irq interrupt
set_connection_parameter_value cpu.d_irq/ISP1362_IF_0.hc_irq irqNumber 7
add_connection cpu.d_irq jtag_uart.irq interrupt
set_connection_parameter_value cpu.d_irq/jtag_uart.irq irqNumber 0
add_connection cpu.d_irq key.irq interrupt
set_connection_parameter_value cpu.d_irq/key.irq irqNumber 1
add_connection cpu.d_irq rs232.irq interrupt
set_connection_parameter_value cpu.d_irq/rs232.irq irqNumber 3
add_connection cpu.d_irq sgdma_rx.csr_irq interrupt
set_connection_parameter_value cpu.d_irq/sgdma_rx.csr_irq irqNumber 6
add_connection cpu.d_irq sgdma_tx.csr_irq interrupt
set_connection_parameter_value cpu.d_irq/sgdma_tx.csr_irq irqNumber 5
add_connection cpu.d_irq sw.irq interrupt
set_connection_parameter_value cpu.d_irq/sw.irq irqNumber 2
add_connection cpu.d_irq timer.irq interrupt
set_connection_parameter_value cpu.d_irq/timer.irq irqNumber 4
add_connection cfi_flash.tcm tri_state_flash_bridge_pinSharer_0.tcs0 tristate_conduit
add_connection tri_state_flash_bridge_pinSharer_0.tcm tri_state_bridge_flash_bridge_0.tcs tristate_conduit

# exported interfaces
add_interface tri_state_bridge_flash_bridge_0_out conduit end
set_interface_property tri_state_bridge_flash_bridge_0_out EXPORT_OF tri_state_bridge_flash_bridge_0.out
add_interface c0_out_clk clock source
set_interface_property c0_out_clk EXPORT_OF c0.out_clk
add_interface c2_out_clk clock source
set_interface_property c2_out_clk EXPORT_OF c2.out_clk
add_interface key_external_connection conduit end
set_interface_property key_external_connection EXPORT_OF key.external_connection
add_interface lcd_external conduit end
set_interface_property lcd_external EXPORT_OF lcd.external
add_interface sd_clk_external_connection conduit end
set_interface_property sd_clk_external_connection EXPORT_OF sd_clk.external_connection
add_interface sd_cmd_external_connection conduit end
set_interface_property sd_cmd_external_connection EXPORT_OF sd_cmd.external_connection
add_interface sd_dat_external_connection conduit end
set_interface_property sd_dat_external_connection EXPORT_OF sd_dat.external_connection
add_interface sd_wp_n_external_connection conduit end
set_interface_property sd_wp_n_external_connection EXPORT_OF sd_wp_n.external_connection
add_interface epp_i2c_scl_external_connection conduit end
set_interface_property epp_i2c_scl_external_connection EXPORT_OF epp_i2c_scl.external_connection
add_interface epp_i2c_sda_external_connection conduit end
set_interface_property epp_i2c_sda_external_connection EXPORT_OF epp_i2c_sda.external_connection
add_interface seg7_conduit_end conduit end
set_interface_property seg7_conduit_end EXPORT_OF seg7.conduit_end
add_interface sw_external_connection conduit end
set_interface_property sw_external_connection EXPORT_OF sw.external_connection
add_interface i2c_scl_external_connection conduit end
set_interface_property i2c_scl_external_connection EXPORT_OF i2c_scl.external_connection
add_interface i2c_sda_external_connection conduit end
set_interface_property i2c_sda_external_connection EXPORT_OF i2c_sda.external_connection
add_interface audio_conduit_end conduit end
set_interface_property audio_conduit_end EXPORT_OF audio.conduit_end
add_interface reset reset sink
set_interface_property reset EXPORT_OF clk_50.clk_in_reset
add_interface altpll_areset_conduit conduit end
set_interface_property altpll_areset_conduit EXPORT_OF altpll.areset_conduit
add_interface altpll_locked_conduit conduit end
set_interface_property altpll_locked_conduit EXPORT_OF altpll.locked_conduit
add_interface altpll_phasedone_conduit conduit end
set_interface_property altpll_phasedone_conduit EXPORT_OF altpll.phasedone_conduit
add_interface altpll_c1 clock source
set_interface_property altpll_c1 EXPORT_OF altpll.c1
add_interface ir_external_connection conduit end
set_interface_property ir_external_connection EXPORT_OF ir.external_connection
add_interface rs232_external_connection conduit end
set_interface_property rs232_external_connection EXPORT_OF rs232.external_connection
add_interface ledr_external_connection conduit end
set_interface_property ledr_external_connection EXPORT_OF ledr.external_connection
add_interface ledg_external_connection conduit end
set_interface_property ledg_external_connection EXPORT_OF ledg.external_connection
add_interface clk_50_clk_in clock sink
set_interface_property clk_50_clk_in EXPORT_OF clk_50.clk_in
add_interface sma_out_external_connection conduit end
set_interface_property sma_out_external_connection EXPORT_OF sma_out.external_connection
add_interface sma_in_external_connection conduit end
set_interface_property sma_in_external_connection EXPORT_OF sma_in.external_connection
add_interface sdram_wire conduit end
set_interface_property sdram_wire EXPORT_OF sdram.wire
add_interface sram_conduit_end conduit end
set_interface_property sram_conduit_end EXPORT_OF sram.conduit_end
add_interface isp1362_if_0_conduit_end conduit end
set_interface_property isp1362_if_0_conduit_end EXPORT_OF ISP1362_IF_0.conduit_end
add_interface tse_mac_conduit_connection conduit end
set_interface_property tse_mac_conduit_connection EXPORT_OF tse_mac.conduit_connection
add_interface altpll_c3 clock source
set_interface_property altpll_c3 EXPORT_OF altpll.c3

save_system de2_115_WEB_Qsys.qsys
